# EAGLE design rev1_5 (EAGLE 7.7.0)
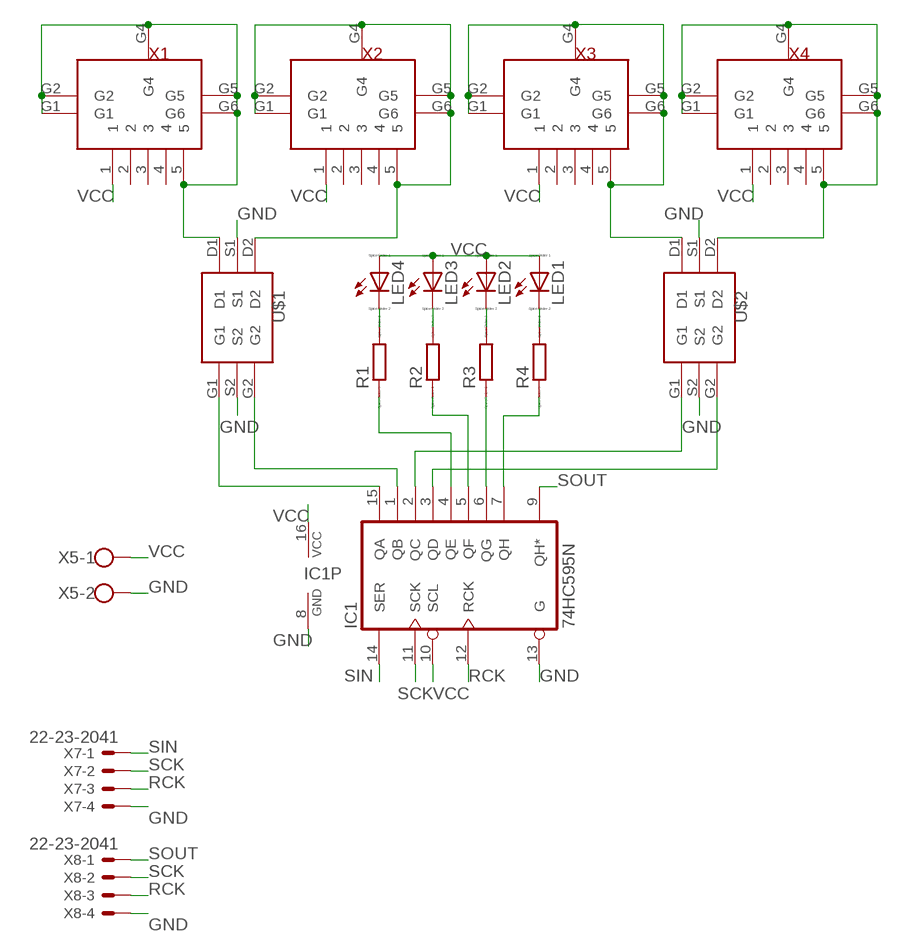
[diagram p0: schematic, sheet 1]

## Parts
IC1  74HC595N  [DIL16]
LED1  LED_E  [LED_1206]
LED2  LED_E  [LED_1206]
LED3  LED_E  [LED_1206]
LED4  LED_E  [LED_1206]
R1  RR1005  [R1005]
R2  RR1005  [R1005]
R3  RR1005  [R1005]
R4  RR1005  [R1005]
U$1  FDC6305N  [FDC6305]
U$2  FDC6305N  [FDC6305]
X1  MUSBV  [MUSBV]
X2  MUSBV  [MUSBV]
X3  MUSBV  [MUSBV]
X4  MUSBV  [MUSBV]
X5  W237-102  [W237-102]
X7  22-23-2041  [22-23-2041]
X8  22-23-2041  [22-23-2041]

## Nets
GND: IC1.8(GND) IC1.13(G) U$1.S1 U$1.S2 U$2.S1 U$2.S2 X5.2 X7.4 X8.4
N$1: IC1.15(QA) U$1.G1
N$2: IC1.1(QB) U$1.G2
N$3: IC1.2(QC) U$2.G1
N$4: IC1.3(QD) U$2.G2
N$5: LED4.C R1.2
N$6: LED3.C R2.2
N$7: LED2.C R3.2
N$8: LED1.C R4.2
N$9: U$1.D1 X1.5 X1.G1 X1.G2 X1.G4 X1.G5 X1.G6
N$10: U$1.D2 X2.5 X2.G1 X2.G2 X2.G4 X2.G5 X2.G6
N$11: U$2.D1 X3.5 X3.G1 X3.G2 X3.G4 X3.G5 X3.G6
N$12: U$2.D2 X4.5 X4.G1 X4.G2 X4.G4 X4.G5 X4.G6
N$13: IC1.4(QE) R1.1
N$14: IC1.5(QF) R2.1
N$15: IC1.6(QG) R3.1
N$16: IC1.7(QH) R4.1
RCK: IC1.12(RCK) X7.3 X8.3
SCK: IC1.11(SCK) X7.2 X8.2
SIN: IC1.14(SER) X7.1
SOUT: IC1.9(QH*) X8.1
VCC: IC1.10(SCL) IC1.16(VCC) LED1.A LED2.A LED3.A LED4.A X1.1 X2.1 X3.1 X4.1 X5.1
Unconnected: X1.2 X1.3 X1.4 X2.2 X2.3 X2.4 X3.2 X3.3 X3.4 X4.2 X4.3 X4.4

## Library data of the parts
IC1 = 74xx-eu:74*595: 8-bit SHIFT REGISTER, output latch
LED1-LED4 = eagle-ltspice:LED_E: LED Source: http://www.osram.convergy.de Source: www.luxeon.com Source: www.kingbright.com; SPICEMODEL: NONE; SPICEPREFIX: D; SPICETYPE: diode
R1-R4 = eagle-ltspice:R: RESISTOR, European symbol; SPICEMODEL: NONE; SPICEPREFIX: R
U$1 U$2 = FDC6305N:FDC6305N
X1-X4 = MUSBV:MUSBV
X5 = con-wago-500:W237-102: WAGO SCREW CLAMP; MPN: 237-102; OC_FARNELL: unknown; OC_NEWARK: 70K9898
X7 X8 = con-molex:22-23-2041: .100" (2.54mm) Center Header - 4 Pin; MF: MOLEX; MPN: 22-23-2041; OC_FARNELL: 1462920; OC_NEWARK: 38C0355

## Board
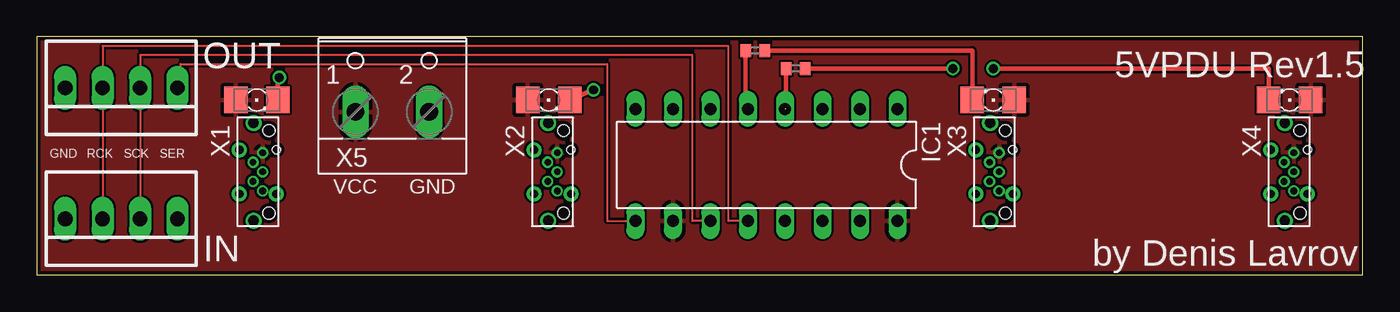
[diagram p1: board, top side]
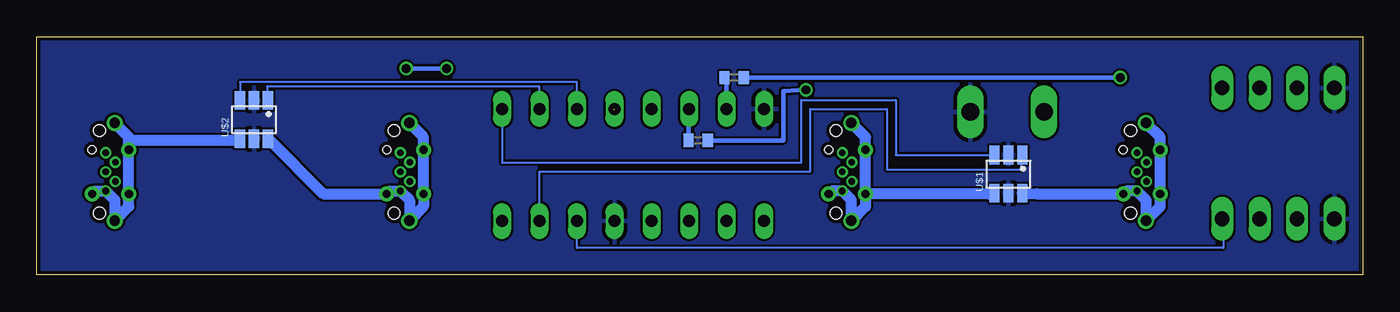
[diagram p2: board, bottom side, seen from below]

Size 90 x 16.18 mm. Coordinates in mm from the lower left corner, seen from the top.
Outline: 0,0 90,0 90,16.18 0,16.18 0,0
Copper layers (1*16): Top 0.035mm / dielectric 1.5mm / Bottom 0.035mm
Design rules "SeeedStudio_2layer_DRU_no_angle_20140221 *": minimum track width 6mil, minimum drill 12mil, track to track 6mil, track to pad 6mil, pad to pad 6mil, via to via 6mil, smd to smd 0mil, copper to edge 10mil, drill to drill 10mil, minimum pad ring 6mil, minimum via ring 6mil, stop-mask expansion 2mil, vias tented up to drill 100mil, thermal gap 10mil

### Footprints (pad centres in the part's own frame; a part is rotated, then mirrored left to right if it is on the bottom)
DIL16 = drill 0.813 long: 1 -8.89,-3.81; 2 -6.35,-3.81; 3 -3.81,-3.81; 4 -1.27,-3.81; 5 1.27,-3.81; 6 3.81,-3.81; 7 6.35,-3.81; 8 8.89,-3.81; 9 8.89,3.81; 10 6.35,3.81; 11 3.81,3.81; 12 1.27,3.81; 13 -1.27,3.81; 14 -3.81,3.81; 15 -6.35,3.81; 16 -8.89,3.81
LED_1206 = smd 1.6 x 1.803: A -1.422,0; C 1.422,0
R1005 = smd 0.7 x 0.9: 1 -0.65,0; 2 0.65,0
FDC6305 = smd 1.27 x 0.7: D1 -0.4,0.55; D2 -0.4,2.45; G1 2.2,0.55; G2 2.2,2.45; S1 -0.4,1.5; S2 2.2,1.5
MUSBV = drill 0.45 pad 0.7: 1 -1.3,0.325; 2 -0.65,-0.325; 3 0,0.325; 4 0.65,-0.325; 5 1.3,0.325 | drill 0.55 pad 1.016: G1 -1.5,-1.25; G4 1.5,1.25; G6 1.5,-1.25 | drill 0.7 pad 1.1: G2 -3.325,-0.29; G5 3.325,-0.29 | hole 0.8: 2.8,0.75; -2.8,0.75 | hole 0.55: -1.5,1.25
W237-102 = drill 1.194 long: 1 -2.5,-1.27; 2 2.5,-1.27
22-23-2041 = drill 1 long: 1 -3.81,0; 2 -1.27,0; 3 1.27,0; 4 3.81,0

### Placement (x,y rotation side)
IC1  49.53,7.47 180 top
LED1  14.94,11.89 0 top
LED2  34.75,11.89 0 top
LED3  64.92,11.89 180 top
LED4  85.04,11.89 180 top
R1  51.51,14.02 0 top
R2  48.77,15.24 0 top
R3  45.11,9.14 0 bottom
R4  42.67,13.41 0 bottom
U$1  22.56,5.94 90 bottom
U$2  73.76,9.65 90 bottom
X1  15,7 270 top
X2  35,7 270 top
X3  65,7 270 top
X4  85,7 270 top
X5  24.13,12.34 0 top
X7  5.73,3.81 180 top
X8  5.73,12.7 180 top

### Tracks (layer width: path | path; a pad name or v marks a point on that pad's centre or on a via)
GND
  pour Bottom: 0,16.15 0,0 89.92,0 89.92,16.15
N$1
  Bottom 0.152: IC1.15 55.88,7.01 37.49,7.01 37.49,11.28 32.31,11.28 32.31,7.16 23.16,7.16 23.16,7.84 U$1.G1
N$2
  Bottom 0.152: IC1.1 58.42,7.62 38.1,7.62 38.1,11.89 31.7,11.89 31.7,8.14 U$1.G2
N$3
  Bottom 0.152: IC1.2 55.88,12.8 74.37,12.8 74.37,11.85 U$2.G1
N$4
  Bottom 0.152: IC1.3 53.34,13.11 76.2,13.11 U$2.G2
N$5  (via drill 0.6)
  Top 0.305: R1.2 v62.18,14.02 | v64.92,14.02 83.62,14.02 LED4.C
  Bottom 0.305: v62.18,14.02 v64.92,14.02
N$6
  Top 0.305: R2.2 63.5,15.24 LED3.C
N$7  (via drill 0.6)
  Top 0.305: v37.8,12.57 LED2.C
  Bottom 0.305: R3.2 39.32,9.14 39.32,12.5 v37.8,12.57
N$8  (via drill 0.6)
  Top 0.305: v16.46,13.41 16.36,13.41 LED1.C
  Bottom 0.305: R4.2 v16.46,13.41
N$9
  Bottom 0.762: X1.G2 13.75,9.37 X1.G1 X1.G6 13.75,4.63 X1.G5 14.71,5.08 X1.5 16.05,5.7 X1.G4 22.15,5.5 U$1.D1
N$10  (1 unrouted)
  Bottom 0.762: X2.G4 36.05,5.7 X2.5 34.71,5.08 X2.G5 33.75,4.63 33.75,5.49 | 33.75,5.49 X2.G1 33.75,9.37 X2.G2 | U$1.D2 25.37,5.49 33.75,5.49
N$11
  Bottom 0.762: X3.G2 63.75,9.37 X3.G1 X3.G6 63.75,4.63 X3.G5 64.71,5.08 X3.5 66.05,5.7 X3.G4 70.56,5.5 U$2.D1
N$12
  Bottom 0.762: 83.75,9.14 X4.G1 X4.G6 83.75,4.63 X4.G5 84.71,5.08 X4.5 86.05,5.7 X4.G4 | 83.75,9.14 83.75,9.37 X4.G2 | U$2.D2 76.32,9.14 83.75,9.14
N$13  (1 unrouted)
  Top 0.305: 50.86,11.28 R1.1
N$14
  Top 0.305: IC1.5 48.12,11.28 R2.1
N$15
  Bottom 0.305: IC1.6 45.76,11.28 R3.1
N$16
  Bottom 0.305: R4.1 43.18,13.41 IC1.7
RCK
  Top 0.152: X7.3 X8.3 4.46,15.54 46.94,15.54 46.94,3.66 IC1.12
SCK
  Top 0.152: X7.2 X8.2 7,14.94 44.5,14.94 44.5,3.66 IC1.11
SIN
  Bottom 0.152: X7.1 9.45,3.81 9.45,1.83 53.34,1.83 IC1.14
SOUT
  Top 0.152: IC1.9 38.71,3.66 38.71,14.33 9.75,14.33 9.75,12.7 X8.1
VCC
  pour Top: 0,16.15 0,0 89.92,0 89.92,16.15

### Text on the board
tPlace: OUT | 5VPDU Rev1.5 | GND | RCK | SCK | SER | VCC | GND | IN | by Denis Lavrov